# Altium schematic sheet 把手锁主板20429.SchDoc
size A2
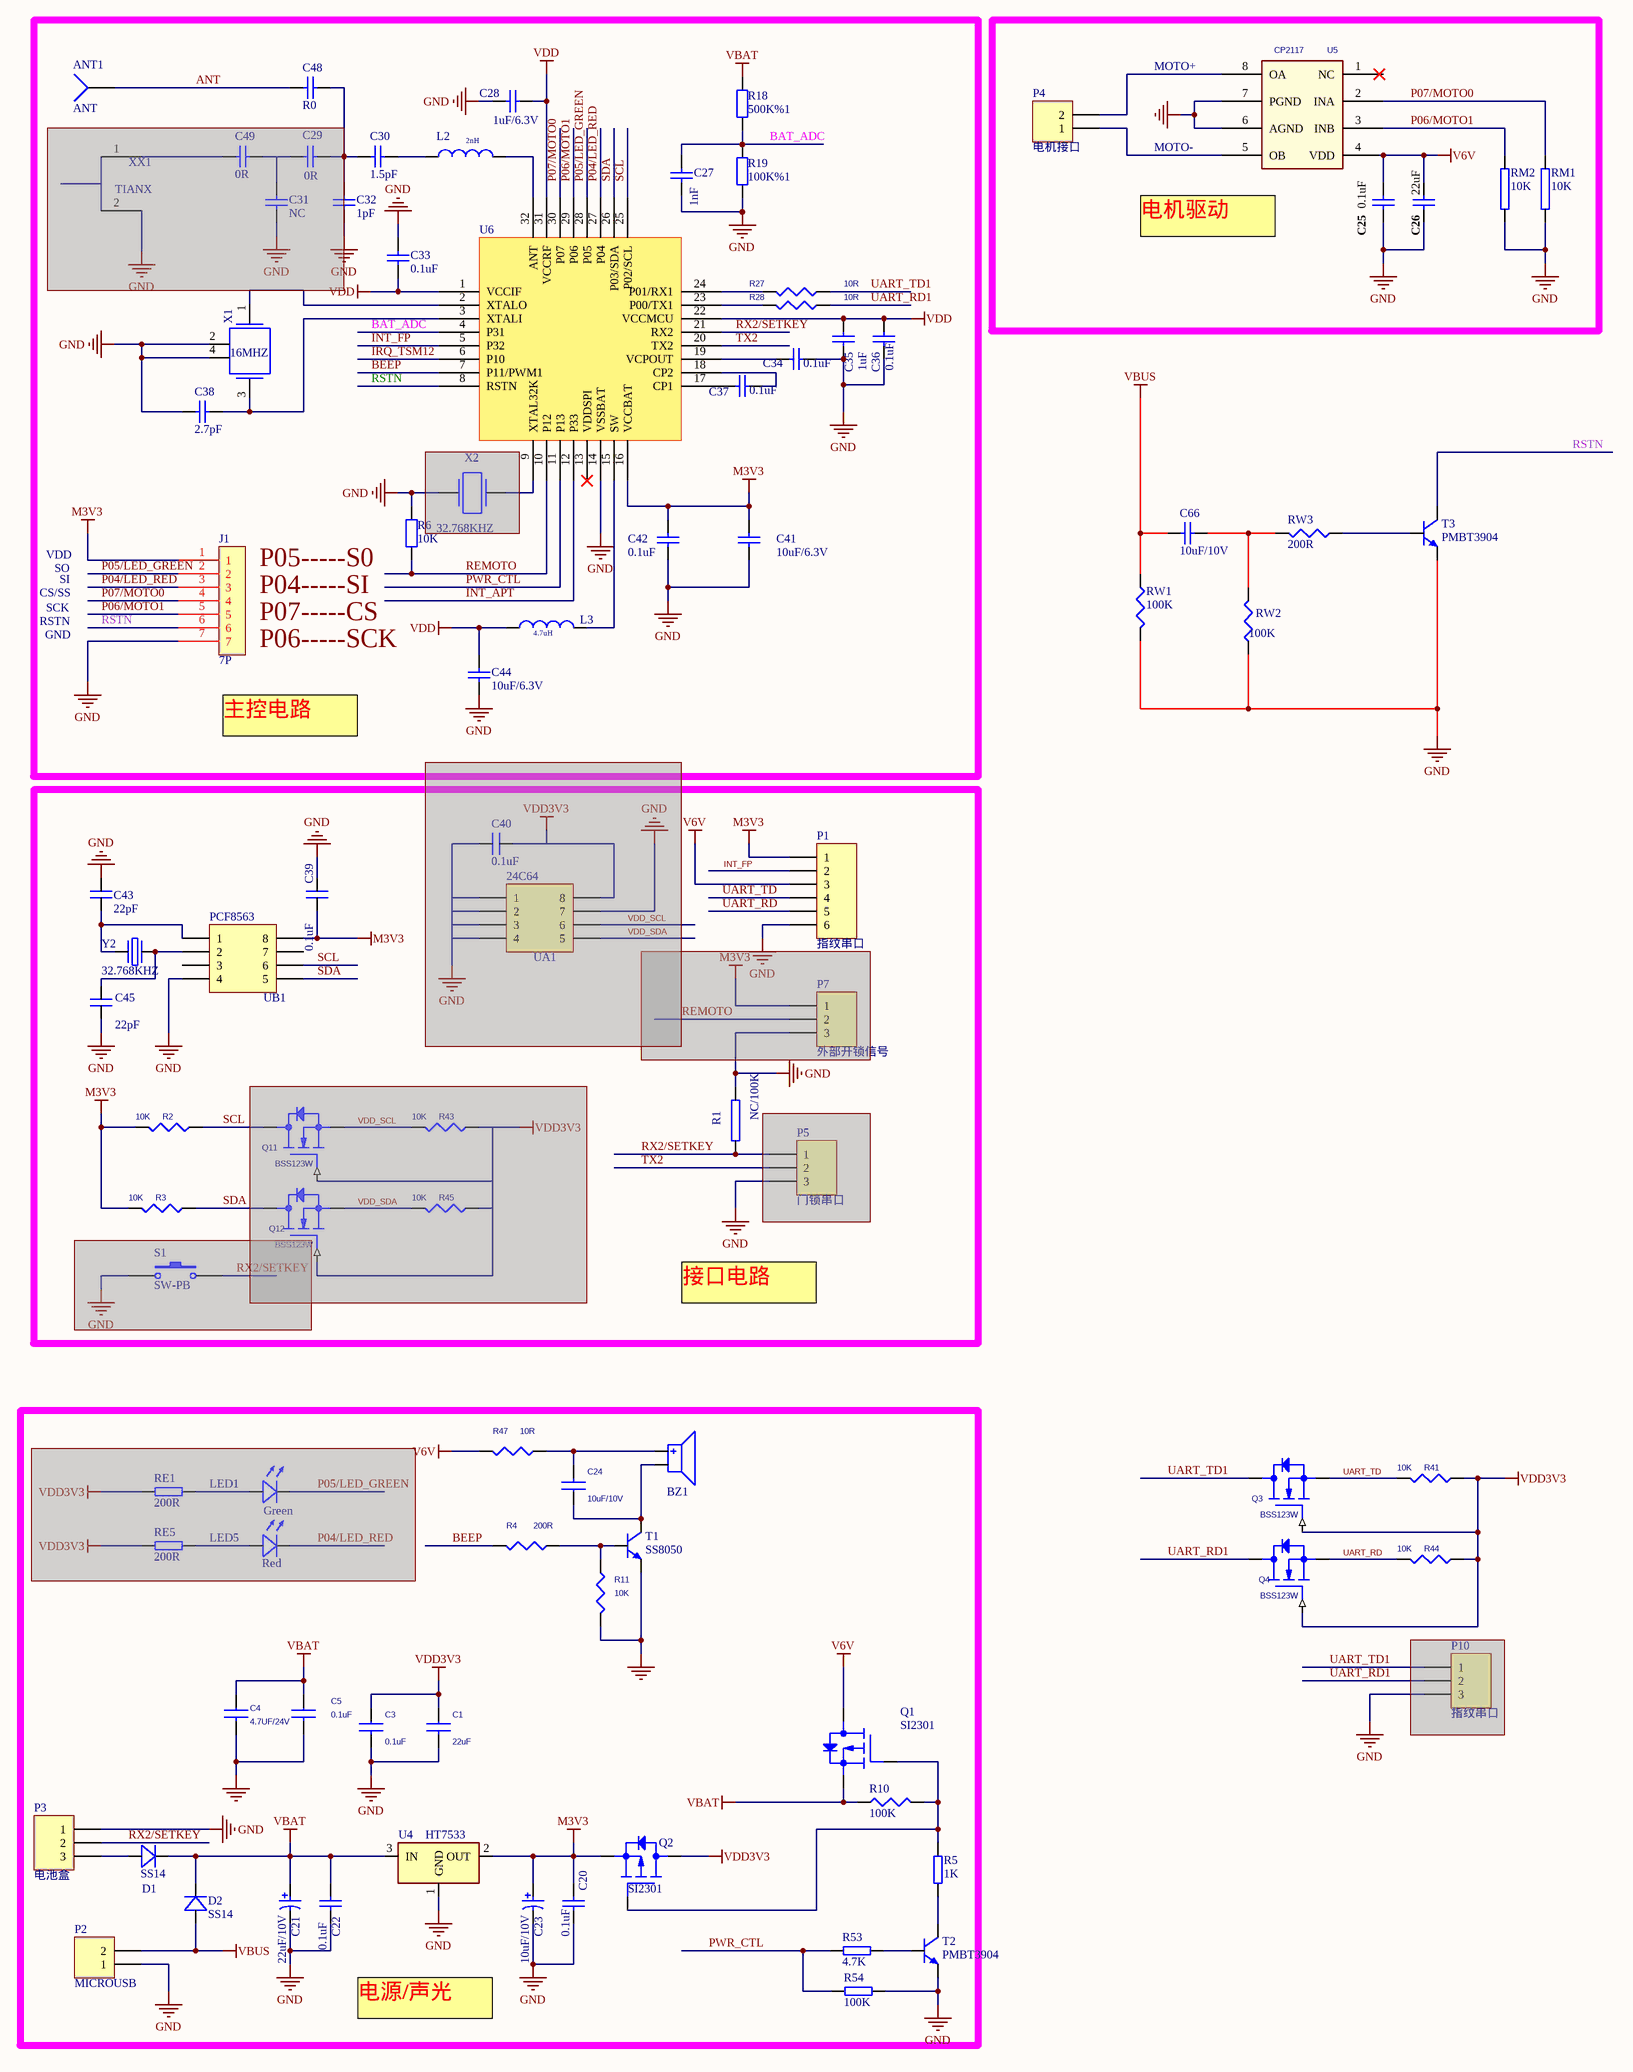
[diagram p0: 把手锁主板20429.SchDoc]

## Parts
ANT1  ANT  [ANT]
BZ1  BUZZER  [BUZZER_D93_L40]  (value not drawn)
C1  22uF  [0805C]
C3  0.1uF  [0603C]
C4  4.7UF/24V  [0805C]
C5  0.1uF  [0603C]
C20  0.1uF  [0603C]
C21  22uF/10V  [0805C]
C22  0.1uF  [0603C]
C23  10uF/10V  [0805C]
C24  10uF/10V  [0603C]
C25  0.1uF  [0603C]
C26  22uF  [0805C]
C27  1nF  [0603C]
C28  1uF/6.3V  [0603C]
C29  0R  [0603C]  (masked out: inside a compile mask, not in the netlist)
C30  1.5pF  [0603C]
C31  NC  [0603C]  (masked out: inside a compile mask, not in the netlist)
C32  1pF  [0603C]  (masked out: inside a compile mask, not in the netlist)
C33  0.1uF  [0603C]
C34  0.1uF  [0603C]
C35  1uF  [0603C]
C36  0.1uF  [0603C]
C37  0.1uF  [0603C]
C38  2.7pF  [0603C]
C39  0.1uF  [0603C]
C40  0.1uF  [0603C]  (masked out: inside a compile mask, not in the netlist)
C41  10uF/6.3V  [0603C]
C42  0.1uF  [0603C]
C43  22pF  [0603C]
C44  10uF/6.3V  [0603C]
C45  22pF  [0603C]
C48  R0  [0603C]
C49  0R  [0603C]  (masked out: inside a compile mask, not in the netlist)
C66  10uF/10V  [0603C]
D1  SS14  [DO-214AA]
D2  SS14  [DO-214AA]
J1  7P  [7P-2.0MM]
L2  2nH  [0603L]
L3  4.7uH  [0805L]
LED1  Green  [0603LED]  (masked out: inside a compile mask, not in the netlist)
LED5  Red  [0603LED]  (masked out: inside a compile mask, not in the netlist)
P1  指纹串口  [SH-1.0-6P]
P2  MICROUSB  [MICRO-USB_F-B]
P3  电池盒  [3P-2.54MM]
P4  电机接口  [S2B-PH-SM3-TB]
P5  门锁串口  [3P-2.54MM]  (masked out: inside a compile mask, not in the netlist)
P7  外部开锁信号  [3P-2.54MM]  (masked out: inside a compile mask, not in the netlist)
P10  指纹串口  [3P-2.54MM]  (masked out: inside a compile mask, not in the netlist)
Q1  SI2301  [SOT-23 - GDS]
Q2  SI2301  [SOT-23 - GDS]
Q3  BSS123W  [SOT-23 - GDS]
Q4  BSS123W  [SOT-23 - GDS]
Q11  BSS123W  [SOT-23 - GDS]  (masked out: inside a compile mask, not in the netlist)
Q12  BSS123W  [SOT-23 - GDS]  (masked out: inside a compile mask, not in the netlist)
R1  NC/100K  [0603R]
R2  10K  [0603R]
R3  10K  [0603R]
R4  200R  [0603R]
R5  1K  [0603R]
R6  10K  [0603R]
R10  100K  [LC-0603_R]
R11  10K  [0603R]
R18  500K%1  [0603R]
R19  100K%1  [0603R]
R27  10R  [0603R]
R28  10R  [0603R]
R41  10K  [0603R]
R43  10K  [0603R]  (masked out: inside a compile mask, not in the netlist)
R44  10K  [0603R]
R45  10K  [0603R]  (masked out: inside a compile mask, not in the netlist)
R47  10R  [0603R]
R53  4.7K  [0603R]
R54  100K  [0603R]
RE1  200R  [0603R]  (masked out: inside a compile mask, not in the netlist)
RE5  200R  [0603R]  (masked out: inside a compile mask, not in the netlist)
RM1  10K  [0603R]
RM2  10K  [0603R]
RW1  100K  [0603R]
RW2  100K  [0603R]
RW3  200R  [0603R]
S1  SW-PB  [6*6H9]  (masked out: inside a compile mask, not in the netlist)
T1  SS8050  [SOT-23-3L]
T2  PMBT3904  [SOT-23-3L]
T3  PMBT3904  [SOT-23-3L]
U4  HT7533  [SOT-23-3L]
U5  CP2117  [SOP8]
U6  BK3431Q  [QFN32_4*4*0.4]  (value not drawn)
UA1  24C64  [SOP8]  (masked out: inside a compile mask, not in the netlist)
UB1  PCF8563  [SOP8]
X1  16MHZ  [XTAL3225]
X2  32.768KHZ  [晶振-9]  (masked out: inside a compile mask, not in the netlist)
XX1  TIANX  [BT_NAMI_1]
Y2  32.768KHZ  [晶振-9]

## Nets
GND: C1.2 C3.2 C4.2 C5.2 C20.2 C21.2 C22.2 C23.2 C25.2 C26.2 C27.1 C28.1 C33.1 C34.2 C35.1 C36.1 C38.1 C39.2 C41.2 C42.2 C43.2 C44.1 C45.1 J1.7 P1.6 P2.5(1) P3.1 R1.2 R6.1 R11.2 R19.2 R54.1 RM1.1 RM2.1 RW1.2 RW2.1 T1.2 T2.2 T3.2 U4.1(GND) U5.6(AGND) U5.7(PGND) U6.14(VSSBAT) UB1.4 X1.2 X1.4
M3V3: C20.1 C23.1 C39.1 C41.1 C42.1 J1.1 P1.1 Q2.S(SOURCE) R2.1 R3.1 U4.2(OUT) U6.16(VCCBAT) UB1.8
V6V: C25.1 C26.1 P1.3 Q1.D(DRAIN) R47.2 U5.4(VDD)
VBAT: C4.1 C5.1 C21.1 C22.1 D1.2(K) D2.2(K) Q1.S(SOURCE) R10.1 R18.1 U4.3(IN)
VBUS: C66.1 D2.1(A) P2.1(2) RW1.1
VDD: C28.2 C33.2 C35.2 C36.2 C44.2 L3.1(P1) U6.1(VCCIF) U6.22(VCCMCU) U6.31(VCCRF)
VDD3V3: C1.1 C3.1 Q2.D(DRAIN) Q3.G(GATE) Q4.G(GATE) R41.2 R44.2
ANT: ANT1.1 C48.1
BAT_ADC: C27.2 R18.2 R19.1 U6.4(P31)
BEEP: R4.2 U6.7(P11/PWM1)
INT_APT: U6.12(P33)
INT_FP: P1.2 U6.5(P32)
IRQ_TSM12: U6.6(P10)
MOTO+: P4.2 U5.8(OA)
MOTO-: P4.1 U5.5(OB)
P04/LED_RED: J1.3 U6.27(P04)
P05/LED_GREEN: J1.2 U6.28(P05)
P06/MOTO1: J1.5 RM2.2 U5.3(INB) U6.29(P06)
P07/MOTO0: J1.4 RM1.2 U5.2(INA) U6.30(P07)
PWR_CTL: R53.1 R54.2 U6.11(P13)
REMOTO: R6.2 U6.10(P12)
RSTN: J1.6 T3.3 U6.8(RSTN)
RX2/SETKEY: P3.2 R1.1 U6.21(RX2)
SCL: R2.2 U6.25(P02/SCL) UB1.6
SDA: R3.2 U6.26(P03/SDA) UB1.5
TX2: U6.20(TX2)
UART_RD: P1.5 Q4.S(SOURCE) R44.1
UART_RD1: Q4.D(DRAIN) R28.1
UART_TD: P1.4 Q3.S(SOURCE) R41.1
UART_TD1: Q3.D(DRAIN) R27.1
NetBZ1_1: BZ1.1 C24.2 R47.1
NetBZ1_2: BZ1.2 C24.1 T1.3
NetC30_1: C30.1 L2.1(P1)
NetC30_2: C30.2 C48.2
NetC34_1: C34.1 U6.19(VCPOUT)
NetC37_1: C37.1 U6.17(CP1)
NetC37_2: C37.2 U6.18(CP2)
NetC38_2: C38.2 U6.3(XTALI) X1.3
NetC43_1: C43.1 UB1.1 Y2.2
NetC45_2: C45.2 UB1.2 Y2.1
NetC66_2: C66.2 RW2.2 RW3.2
NetD1_1: D1.1(A) P3.3
NetL2_2: L2.2(P2) U6.32(ANT)
NetL3_2: L3.2(P2) U6.15(SW)
NetQ1_G: Q1.G(GATE) Q2.G(GATE) R5.1 R10.2
NetR4_1: R4.1 R11.1 T1.1
NetR5_2: R5.2 T2.3
NetR27_2: R27.2 U6.24(P01/RX1)
NetR28_2: R28.2 U6.23(P00/TX1)
NetR53_2: R53.2 T2.1
NetRW3_1: RW3.1 T3.1
NetU6_2: U6.2(XTALO) X1.1

Not connected (* = marked no-connect by the designer): U5 1(NC); U6 9(XTAL32K) 13(VDDSPI)*; UB1 3 7; XX1 1 2

## Notes on the sheet
- (near U5) 电机驱动
- VDD
- RSTN
- CS/SS
- SCK
- SO
- SI
- P04-----SI
- (near R6) P05-----S0
- P07-----CS
- GND
- (near J1) P06-----SCK
- 主控电路
- 接口电路
- 电源/声光

## Library data of the parts
ANT1 = Socket: LatestRevisionDate: 17-Jul-2002; LatestRevisionNote: Re-released for DXP Platform.; Publisher: Altium Limited
C1 C3-C5 = CAP NP
C20 C22 C25-C27 C66 = CAP-NP: Capacitor, Ceramic; Capacitance: 18 pF; Dielectric: COG; Polarity: Non-Polarized; Rated Voltage: 50 mV; Tolerance: 5 %; Category: Capacitor; Mounting Technology: Surface Mount; Status: Unreleased; Technology: Ceramic
C21 C23 = CAP-P: Capacitor, tolerance ±20%
C24 = C_0_Dup1
C28-C38 C41 C42 C44 C48 C49 = Cap: Capacitor; Value: 10pF; Published: 8-Jun-2000; LatestRevisionDate: 17-Jul-2002; LatestRevisionNote: Re-released for DXP Platform.; PackageReference: RAD-0.3; Publisher: Altium Limited; PackageDescription: Radial Cap, Thru-Hole; 2 Leads; 0.3 in Pin Spacing
C39 C40 C43 C45 = C
D1 D2 = D
L2 L3 = INDUCTOR: Power Inductor, 4.7uH, 0.7A, 260mR DCR; XMOS Part Number: E-09-0011; Manufacturer: Taiyo Yuden; Manufacturer Part Number: CBC2518T4R7M; Part Creator: JG; LEVEL: STD; DEVICE: L; FORWARD_PCB: 1; Tolerance (%): 20; Max DC Resistance: 0.26R; Rated Current (Saturation): 0.68A; Rated Current (Temp Rise): 0.92A; Approx Volume Cost ($): 0.07; Approved: NO; VALUE: 2.0nH; Datasheet: http://www.yuden.co.jp/us/product/pdf/ecb2_e.pdf; Max Height (mm): 2; Digikey Link: http://search.digikey.com/scripts/DkSearch/dksus.dll?lang=en&site=US&keywords=CBC2518T4R7M
LED1 LED5 = LED
P1 = Header 6: Header, 6-Pin; LatestRevisionDate: 17-Jul-2002; LatestRevisionNote: Re-released for DXP Platform.; Publisher: Altium Limited
P2 P4 = MHDR1X2: Header, 2-Pin; LatestRevisionDate: 17-Jul-2002; LatestRevisionNote: Re-released for DXP Platform.; Publisher: Altium Limited
P3 P5 P7 P10 = Header 3: Header, 3-Pin; LatestRevisionDate: 17-Jul-2002; LatestRevisionNote: Re-released for DXP Platform.; Publisher: Altium Limited
Q1 Q2 = PWRMOSFET_EP_DGS_0
Q3 Q4 Q11 Q12 = BSS123L_0
R1 RM1 RM2 = Pro71C3.TMP_UnNamed_1
R2 R3 R41 R43-R45 = RES
R4 R11 R27 R28 R47 = R_Dup1
R5 R10 R53 R54 RE1 RE5 RW1-RW3 = R
R6 R18 R19 = Res2: Resistor; Value: 470K; Published: 2013年12月24日; LatestRevisionDate: 2013年12月24日; LatestRevisionNote: Re-released for DXP Platform.
S1 = SW-PB: Switch; Published: 24-Mar-1999; LatestRevisionDate: 17-Jul-2002; LatestRevisionNote: Re-released for DXP Platform.; PackageReference: SPST-2; Publisher: Altium Limited
T1-T3 = NPN_BJT: Bipolar Junction Transistor
U4 = XC6206P302M
U5 = AM24LC02_0
UA1 UB1 = IC8
X1 = OSC: XMOS Part Number: E-07-0030; Manufacturer: Abracon; Manufacturer Part Number: ABLS-24.000MHz-B4; Part Creator: JG; LEVEL: STD; DEVICE: X; FORWARD_PCB: 1; Approx Volume Cost ($): 0.15; Approved: NO; VALUE: ABLS; FREQUENCY: 38.4MHZ; Datasheet: http://www.abracon.com/Resonators/abls.pdf; Max Height (mm): 4.2; Supplier Link: http://search.digikey.com/scripts/DkSearch/dksus.dll?lang=en&site=US&keywords=ABLS-24.000MHz-B4
X2 = CRYSTAL: Crystal, 24MHz, HC49/US SMD, Fundamental, 18pF, Tol. ?0ppm, Stab. ?0ppm; XMOS Part Number: E-07-0030; Manufacturer: Abracon; Manufacturer Part Number: ABLS-24.000MHz-B4; Part Creator: JG; LEVEL: STD; DEVICE: X; FORWARD_PCB: 1; Approx Volume Cost ($): 0.15; Approved: NO; VALUE: ABLS; Datasheet: http://www.abracon.com/Resonators/abls.pdf; Max Height (mm): 4.2; Supplier Link: http://search.digikey.com/scripts/DkSearch/dksus.dll?lang=en&site=US&keywords=ABLS-24.000MHz-B4; FREQUENCY: 32.768KHZ
Y2 = 晶振